# EAGLE design REMOT_ (EAGLE 9.6.2)
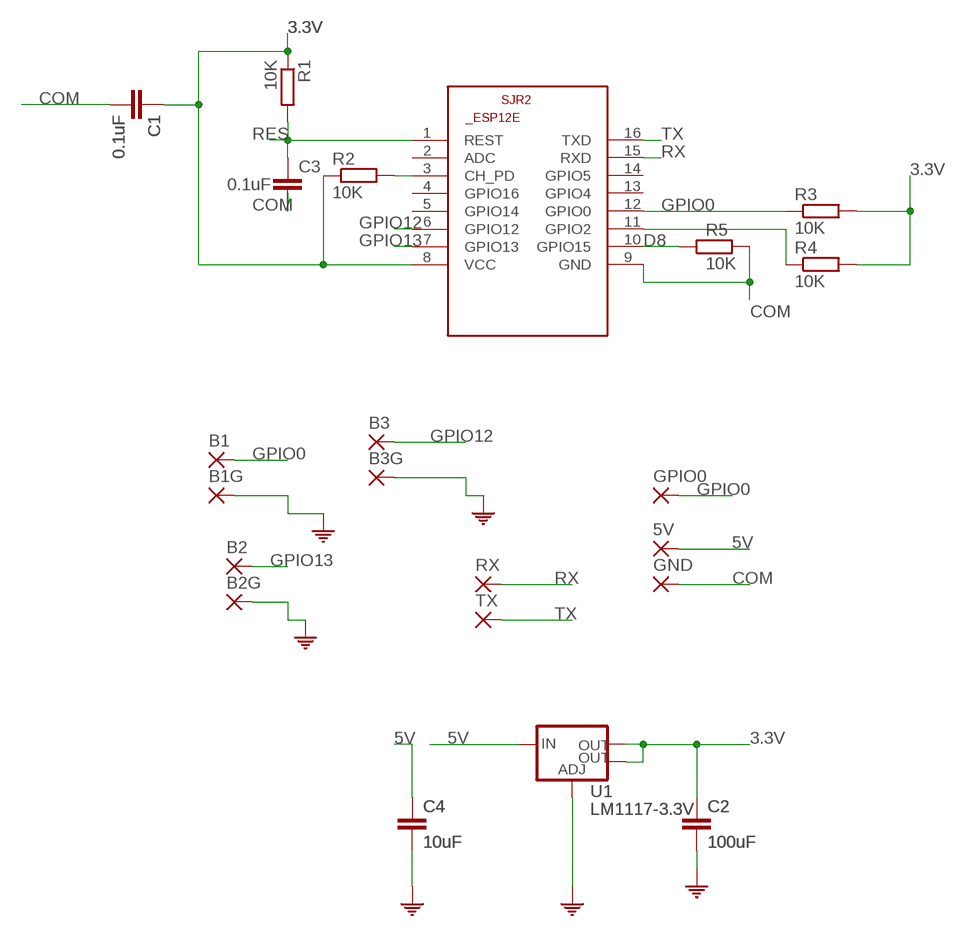
[diagram p0: schematic, sheet 1]

## Parts
5V  SMD2  [SMD1,27-2,54]
B1  SMD2  [SMD1,27-2,54]
B1G  COM  SMD2  [SMD1,27-2,54]
B2  SMD2  [SMD1,27-2,54]
B2G  SMD2  [SMD1,27-2,54]
B3  SMD2  [SMD1,27-2,54]
B3G  SMD2  [SMD1,27-2,54]
C1  0.1uF  C-EUC1206  [C1206]
C2  100uF  C-EUC1206  [C1206]
C3  0.1uF  C-EUC1206  [C1206]
C4  10uF  C-EUC1206  [C1206]
GND  SMD2  [SMD1,27-2,54]
GPIO0  SMD2  [SMD1,27-2,54]
R1  10K  R-EU_R0805  [R0805]
R2  10K  R-EU_R0805  [R0805]
R3  10K  R-EU_R0805  [R0805]
R4  10K  R-EU_R0805  [R0805]
R5  10K  R-EU_R0805  [R0805]
RX  SMD2  [SMD1,27-2,54]
SJR2  ESP8266-12EESP12E  [ESP8266-ESP12E]
TX  SMD2  [SMD1,27-2,54]
U1  LM1117-3.3V  V_REG_LM1117SOT223  [SOT223]

## Nets
3.3V: C1.1 C2.1 R1.1 R2.1 R3.2 R4.2 SJR2.8(VCC) U1.2(OUT) U1.4(OUT)
5V: 5V.1(P) C4.1 U1.3(IN)
COM: B1G.1(P) B2G.1(P) B3G.1(P) C1.2 C2.2 C3.2 C4.2 GND.1(P) R5.2 SJR2.9(GND) U1.1(ADJ)
D8: R5.1 SJR2.10(GPIO15)
GPIO0: B1.1(P) GPIO0.1(P) R3.1 SJR2.12(GPIO0)
GPIO12: B3.1(P) SJR2.6(GPIO12)
GPIO13: B2.1(P) SJR2.7(GPIO13)
N$23: R4.1 SJR2.11(GPIO2)
N$27: R2.2 SJR2.3(CH_PD)
RES: C3.1 R1.2 SJR2.1(REST)
RX: RX.1(P) SJR2.15(RXD)
TX: SJR2.16(TXD) TX.1(P)
Unconnected: SJR2.2(ADC) SJR2.4(GPIO16) SJR2.5(GPIO14) SJR2.13(GPIO4) SJR2.14(GPIO5)

## Library data of the parts
5V B1 B1G B2 B2G B3 B3G GND GPIO0 RX TX = wirepad:SMD2: SMD PAD
C1-C4 = rcl:C-EU: CAPACITOR, European symbol; SPICEPREFIX: C
R1-R5 = resistor:R-EU_: RESISTOR, European symbol
SJR2 = esp12e:ESP8266-12E: ESP8266-12E Library for Eagle CAD The author not responsible for any damages or errors!. Created by Suhail jr.lt;/author>
U1 = SparkFun-IC-Power:V_REG_LM1117: Voltage Regulator LM1117 Standard adjustable voltage regulator but in SMD form. Spark Fun Electronics SKU : COM-00595; PROD_ID: VREG-08170

## Board
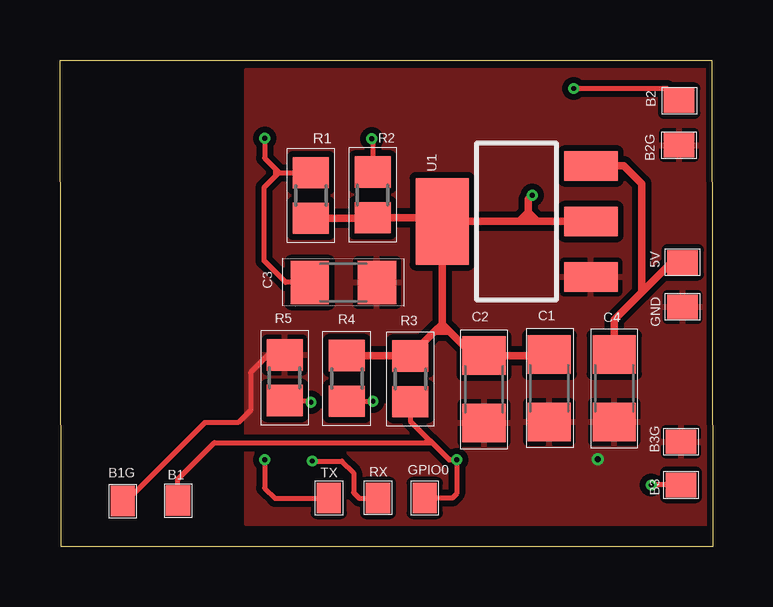
[diagram p1: board, top side]
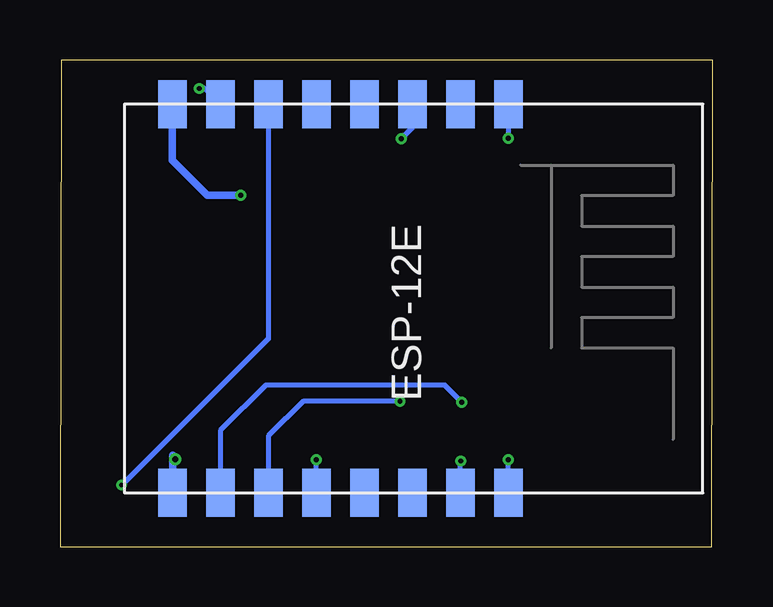
[diagram p2: board, bottom side, seen from below]

Size 27.2 x 20.28 mm. Coordinates in mm from the lower left corner, seen from the top.
Outline: 0,20.28 27.15,20.28 27.2,0 0.06,0 0,20.28
Copper layers (1*16): Top 0.018mm / dielectric 1.55mm / Bottom 0.018mm
Design rules "default *": minimum track width 0.15mm, minimum drill 0.2mm, track to track 0.15mm, track to pad 0.15mm, pad to pad 0.15mm, via to via 0.15mm, smd to smd 0mil, copper to edge 0.25mm, drill to drill 0.35mm, minimum pad ring 0.175mm, minimum via ring 0.125mm, stop-mask expansion 1mil, vias tented up to drill 0.35mm, thermal gap 0.2mm

### Footprints (pad centres in the part's own frame; a part is rotated, then mirrored left to right if it is on the bottom)
SMD1,27-2,54 = smd 1.016 x 1.27: 1 0,0
C1206 = smd 1.6 x 1.8: 1 -1.4,0; 2 1.4,0
R0805 = smd 1.3 x 1.5: 1 -0.95,0; 2 0.95,0
ESP8266-ESP12E = smd 2 x 1.2: 1 -7.62,5.84; 2 -7.62,3.84; 3 -7.62,1.84; 4 -7.62,-0.16; 5 -7.62,-2.16; 6 -7.62,-4.16; 7 -7.62,-6.16; 8 -7.62,-8.16; 9 8.58,-8.16; 10 8.58,-6.16; 11 8.58,-4.16; 12 8.58,-2.16; 13 8.58,-0.16; 14 8.58,1.84; 15 8.58,3.84; 16 8.58,5.84
SOT223 = smd 1.219 x 2.235: 1 -2.311,-3.099; 2 0,-3.099; 3 2.311,-3.099 | smd 3.6 x 2.2: 4 0,3.099

### Placement (x,y rotation side)
5V  25.94,11.85 90 top
B1  4.92,1.92 0 top
B1G  2.62,1.91 0 top
B2  25.8,18.59 270 top
B2G  25.8,16.74 90 top
B3  25.88,2.58 90 top
B3G  25.88,4.38 90 top
C1  20.39,6.61 270 top
C2  17.67,6.56 270 top
C3  11.81,11.02 0 top
C4  23.09,6.61 270 top
GND  25.94,10 90 top
GPIO0  15.2,2.03 0 top
R1  10.45,14.64 90 top
R2  13.03,14.66 90 top
R3  14.59,7 90 top
R4  11.95,7.02 90 top
R5  9.36,7.05 90 top
RX  13.25,2.03 0 top
SJR2  14.36,10.83 270 bottom
TX  11.2,2.03 0 top
U1  19.02,13.56 90 top

### Tracks (layer width: path | path; a pad name or v marks a point on that pad's centre or on a via)
3.3V  (via drill 0.2)
  Top 0.305: R1.1 13.01,13.69 R2.1 15.77,13.71 U1.4 | R4.2 14.58,7.97 R3.2 15.62,8.98 | C1.1 20.34,7.96 C2.1 17.23,7.96 16.22,8.98 | U1.4 19.14,13.56 | 19.14,13.56 19.51,13.56 | 19.51,13.56 19.89,13.56 | 19.89,13.56 U1.2 | U1.4 15.92,9.28 | 15.92,9.28 15.62,8.98 | 15.92,9.28 16.22,8.98 | 15.62,8.98 16.22,8.98 | 19.51,13.56 19.51,13.94 | 19.51,13.94 19.51,14.48 v19.67,14.65 | 19.51,13.94 19.14,13.56 | 19.51,13.94 19.89,13.56
  Bottom 0.305: v19.67,14.65 21.06,14.65 22.52,16.11 SJR2.8
5V
  Top 0.305: U1.3 23.49,15.87 24.24,15.12 24.24,10.6 | 24.24,10.6 23.09,9.45 C4.1 | 5V.1 25.49,11.85 24.24,10.6
COM  (via drill 0.25)
  Top 0.203: R5.2 8.67,7.99 7.95,7.27 7.95,5.7 7.42,5.18 6.03,5.18 2.75,1.91 B1G.1
  Bottom 0.305: v22.4,3.64 22.4,3.71 22.5,3.81 22.5,2.67
  Bottom 0.406: 22.5,2.67 22.5,2.27 SJR2.9
  pour Top (isolate 0.25): 7.73,19.89 27.05,19.89 27.05,0.94 7.73,0.94
D8  (via drill 0.2)
  Top 0.203: R5.1 10.39,6.09 v10.46,6.03
  Bottom 0.203: v10.46,6.03 11.17,6.74 18.63,6.74 20.52,4.85 SJR2.10
GPIO0  (via drill 0.2)
  Top 0.203: v16.53,3.63 16.53,2.21 16.34,2.03 GPIO0.1 | R3.1 14.59,5.24 16.22,3.62 16.52,3.62 v16.53,3.63 | v16.53,3.63 16.22,3.63 15.5,4.34 15.21,4.34 6.44,4.34 4.92,2.83 B1.1
  Bottom 0.203: SJR2.12 v16.52,3.62 v16.53,3.63
GPIO12  (via drill 0.2)
  Top 0.203: B3.1 v24.64,2.58
  Bottom 0.203: SJR2.6 18.52,8.66 24.61,2.58 v24.64,2.58
GPIO13  (via drill 0.2)
  Top 0.203: v21.4,19.1 25.28,19.1 B2.1
  Bottom 0.203: SJR2.7 21.17,19.1 v21.4,19.1
N$23  (via drill 0.2)
  Top 0.203: R4.1 v13.03,6.07 v13.04,6.06
  Bottom 0.203: v13.04,6.06 17.08,6.06 18.52,4.62 SJR2.11
N$27  (via drill 0.2)
  Top 0.203: v12.98,17 13.03,16.96 R2.2
  Bottom 0.203: v12.98,17 12.52,17.47 SJR2.3
RES  (via drill 0.2)
  Top 0.203: v8.53,17.02 8.53,16.2 8.96,15.76 | 9.13,15.59 9.12,15.59 8.96,15.44 | 9.13,15.59 R1.2 | 8.96,15.76 9.13,15.59 | C3.1 9.41,11.02 8.5,11.92 8.5,14.98 8.95,15.43 8.96,15.44 | 8.96,15.76 8.96,15.44
  Bottom 0.203: SJR2.1 v8.52,17.03 v8.53,17.02
RX  (via drill 0.2)
  Top 0.203: v10.51,3.58 11.74,3.58 12.23,3.08 12.23,2.26 12.46,2.03 RX.1
  Bottom 0.203: SJR2.15 v10.52,3.56 v10.51,3.58
TX  (via drill 0.2)
  Top 0.203: v8.53,3.62 8.53,2.45 8.97,2.02 11.18,2.02 TX.1
  Bottom 0.203: SJR2.16 v8.52,3.62 v8.53,3.62